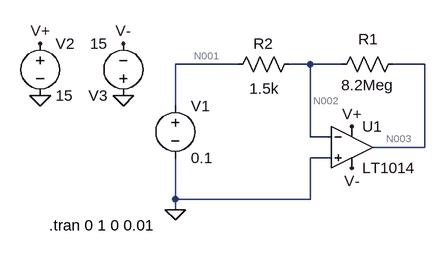
[diagram p0: schematic InvertierenderVerstärker.asc]
InvertierenderVerstärker.asc, the LTspice schematic file:
Version 4
SHEET 1 880 680
WIRE 48 0 -48 0
WIRE 160 0 128 0
WIRE 208 0 160 0
WIRE 336 0 288 0
WIRE -48 64 -48 0
WIRE 160 112 160 0
WIRE 192 112 160 112
WIRE 336 128 336 0
WIRE 336 128 256 128
WIRE 192 144 160 144
WIRE -48 208 -48 144
WIRE 160 208 160 144
WIRE 160 208 -48 208
WIRE -48 224 -48 208
FLAG -48 224 0
FLAG -256 -32 V+
FLAG -128 -32 V-
FLAG -128 48 0
FLAG -256 48 0
FLAG 224 96 V+
FLAG 224 160 V-
SYMBOL Opamps\\LT1014 224 64 R0
SYMATTR InstName U1
SYMBOL res 304 -16 R90
WINDOW 0 -7 55 VBottom 2
WINDOW 3 32 56 VTop 2
SYMATTR InstName R1
SYMATTR Value 8.2Meg
SYMBOL res 144 -16 R90
WINDOW 0 0 56 VBottom 2
WINDOW 3 38 55 VTop 2
SYMATTR InstName R2
SYMATTR Value 1.5k
SYMBOL voltage -48 48 R0
WINDOW 123 0 0 Left 2
WINDOW 39 0 0 Left 2
SYMATTR InstName V1
SYMATTR Value 0.1
SYMBOL voltage -256 -48 R0
WINDOW 123 0 0 Left 2
WINDOW 39 0 0 Left 2
SYMATTR InstName V2
SYMATTR Value 15
SYMBOL voltage -128 64 R180
WINDOW 123 0 0 Left 2
WINDOW 39 0 0 Left 2
SYMATTR InstName V3
SYMATTR Value 15
TEXT -242 248 Left 2 !.tran 0 1 0 0.01

The netlist it stands for:
* InvertierenderVerstärker.asc
XU1 0 N002 V+ V- N003 LT1014  ; pins In+ In- V+ V- OUT
R1 N003 N002 8.2Meg
R2 N002 N001 1.5k
V1 N001 0 0.1
V2 V+ 0 15
V3 0 V- 15
.tran 0 1 0 0.01
.backanno
.end

* Results of the author's LTspice run, read from the files saved beside the schematic
* Operating Point, zero values left out:
*   V(n002) = 97.26 mV
*   V(v+) = 15 V
*   V(v-) = -15 V
*   V(n003) = -14.98 V
*   V(n001) = 100 mV
*   I(R2) = -1.827 µA
*   I(R1) = -1.839 µA
*   I(V3) = -137.9 µA
*   I(V2) = -145 µA
*   I(V1) = -1.827 µA
*   Ix(u1:1) = -12.24 nA
*   Ix(u1:2) = -11.78 nA
*   Ix(u1:3) = 145 µA
*   Ix(u1:4) = -137.9 µA
*   Ix(u1:5) = 1.839 µA